# EasyEDA Pro project PROJECT.epro

# Schematic Schematic1
Board Name: Board1; Create Date: 2025-12-16; Page Name: P1; Project Name: Kamo, Rubber Ducky; Schematic Name: Schematic1; Update Date: 2025-12-16; Company: Kamo, a Custom Rubber Ducky; Page Size: A5; Version: V1.0
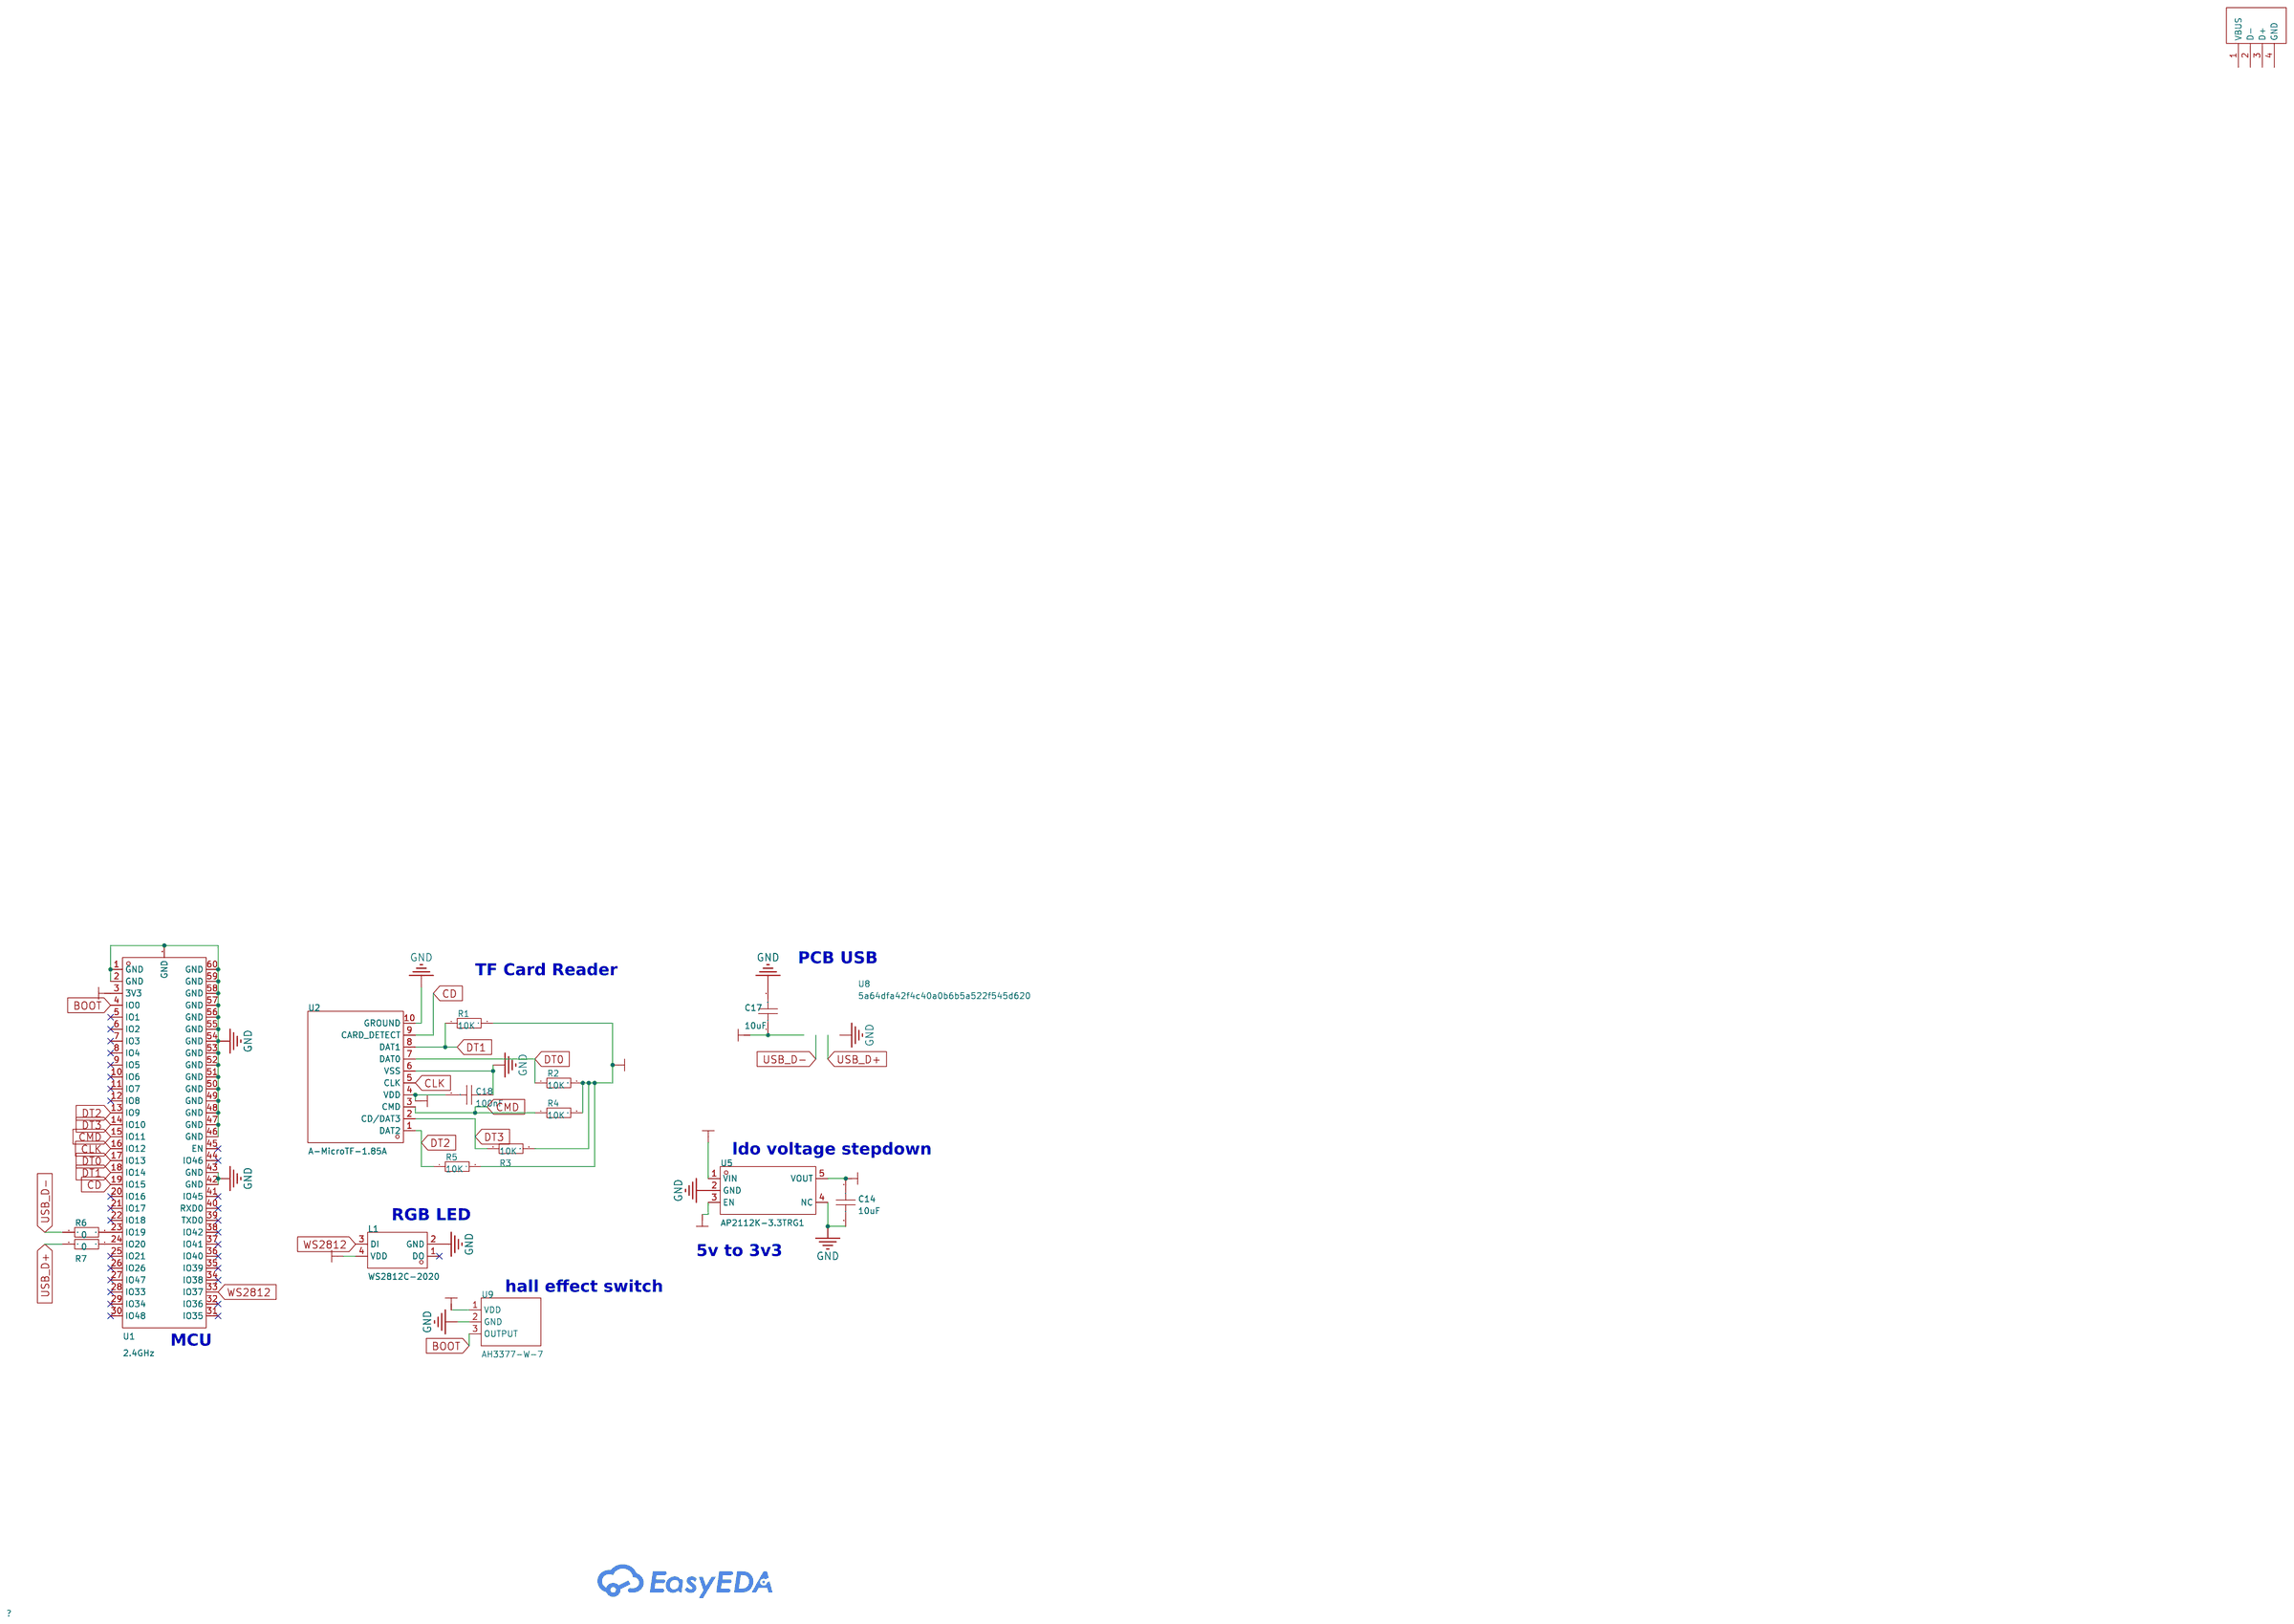
[diagram p0: schematic sheet]

## Parts
C14  10uF  [C0603]
C17  10uF  [C0603]
C18  100nF  [C0603]
L1  WS2812C-2020  [LED-SMD_L2.2-W2.0]
R1  10K  [R0603]
R2  10K  [R0603]
R3  10K  [R0603]
R4  10K  [R0603]
R5  10K  [R0603]
R6  0  [R0603]
R7  0  [R0603]
U1  2.4GHz  [BULETM-SMD_ESP32-S3-MINI-1-N8]
U2  A-MicroTF-1.85A  [TF-SMD_A-MICROTF-1.85A]
U5  AP2112K-3.3TRG1  [SOT-25-5_L2.9-W1.6-P0.95-LS2.8-BL]
U8  5a64dfa42f4c40a0b6b5a522f545d620  [USB-A_PCB]
U9  AH3377-W-7  [SC-59-3_L3.0-W1.6-P0.95-LS2.9-BR-CW]

## Library data of the parts
C14 C17 C18 = CAP_0603: Supplier Footprint: 0603
L1 = WS2812C-2020: Wavelength:460nm；520nm；623nm Operating Temperature:-25℃~+85℃; Supplier Part: C965556; Manufacturer: worldsemi; Supplier Footprint: SMD,2x2mm; Datasheet: https://atta.szlcsc.com/upload/public/pdf/source/20201203/C965556_B52DCEA0E250ABD59F33ED24C4AD3075.pdf; Supplier: LCSC; Wavelength: 460nm；520nm；623nm; Operating Temperature: -25℃~+85℃
R1-R7 = Res_0603: Supplier Footprint: 0603
U1 = ESP32-S3-MINI-1-N8: Core Processor:ESP32-S3FN8 Chip Wireless Standard:- Support Interface:I2C；GPIO；SPI；PWM；ADC；UART；USB；I2S Frequency:2.4GHz Antenna Type:- Output Power:20.5dBm Output Power:20.5dBm Operating Voltage:- Operating Voltage:- Receive  Current:- Send  Current:- Se; Supplier Part: C2913206; Manufacturer: ESPRESSIF(乐鑫); Supplier Footprint: SMD; JLCPCB Part Class: Extended Part; Datasheet: https://atta.szlcsc.com/upload/public/pdf/source/20220425/7F117D7A09F85946280540FD9EFDF9F3.pdf; Supplier: LCSC; Core Processor: ESP32-S3FN8 Chip; Support Interface: I2C；GPIO；SPI；PWM；ADC；UART；USB；I2S; Output Power: 20.5dBm
U2 = A-MicroTF-1.85A: Card Connection Mode:Push-Push Card Type:MicroSD Card (TF Card) Connector Type:Connector and Ejector Additional Card Detection Pins:- Supplementary Features:- Height Above Board:1.85mm Operating Temperature:-25℃~+85℃ Operating Temperature:-25℃~+85℃; LCSC Part Name: 自弹式 MicroSD卡(TF卡) 卡座; Supplier Part: C22467599; Manufacturer: MyAntenna(摩天射频); Supplier Footprint: SMD; JLCPCB Part Class: Extended Part; Datasheet: https://item.szlcsc.com/datasheet/A-MicroTF-1.85A/24170456.html; Supplier: LCSC; Card Connection Mode: Push-Push; Card Type: MicroSD Card (TF Card); Connector Type: Connector and Ejector; Height Above Board: 1.85mm; Operating Temperature: -25℃~+85℃
U5 = AP2112K-3.3TRG1: Output Type:Fixed Maximum Input Voltage:6V Output Voltage:3.3V Output Voltage:3.3V Output Current:600mA Power Supply Rejection Ratio (PSRR):65dB@(1kHz) Dropout Voltage:400mV@(600mA) standby current:80uA Feature:ESD Protection；Automatic Discharge Function；; LCSC Part Name: 输入6V 输出3.3V 600mA; Supplier Part: C51118; Manufacturer: DIODES(美台); Supplier Footprint: SOT-25-5; JLCPCB Part Class: Extended Part; Datasheet: https://atta.szlcsc.com/upload/public/pdf/source/20171221/C51118_15138312998391195590.pdf; Supplier: LCSC; Output Type: Fixed; Maximum Input Voltage: 6V; Output Voltage: 3.3V; Output Current: 600mA; Power Supply Rejection Ratio (PSRR): 65dB@(1kHz); Dropout Voltage: 400mV@(600mA); standby current: 80uA; Feature: ESD Protection；Automatic Discharge Function；Low ESR；Thermal Protection(TSD)；Overcurrent Protection(OCP)；With ability; Operating Temperature: -40℃~+85℃; Output Polarity: Positive electrode; Number of Outputs: 1
U8 = USB-A_PCB
U9 = AH3377-W-7: Type:Unipolar Voltage - Supply:3V~28V Voltage - Supply:3V~28V Operation Points:11.5mT Operation Points:11.5mT Release Points:9mT Release Points:9mT Operating Temperature:-40℃~+125℃ Operating Temperature:-40℃~+125℃ Operating Current:3mA Output Type:Open Dr; LCSC Part Name: 高电压低灵敏度霍尔效应单极开关; Supplier Part: C842204; Manufacturer: DIODES(美台); Supplier Footprint: SC-59; JLCPCB Part Class: Extended Part; Datasheet: https://item.szlcsc.com/datasheet/AH3377-W-7/900535.html; Supplier: LCSC; Type: Unipolar; Voltage - Supply: 3V~28V; Operation Points: 11.5mT; Release Points: 9mT; Operating Temperature: -40℃~+125℃; Operating Current: 3mA; Output Type: Open Drain

## Nets
+3V3: C14.1 C18.2 L1.4(VDD) R1.2 R2.2 R3.2 R4.2 R5.2 U1.3(3V3) U2.4(VDD) U5.5(VOUT) U9.1(VDD)
GND: C14.2 C17.2 C18.1 L1.2(GND) U1.1(GND) U1.2(GND) U1.42(GND) U1.43(GND) U1.46(GND) U1.47(GND) U1.48(GND) U1.49(GND) U1.50(GND) U1.51(GND) U1.52(GND) U1.53(GND) U1.54(GND) U1.55(GND) U1.56(GND) U1.57(GND) U1.58(GND) U1.59(GND) U1.60(GND) U1.GND U2.6(VSS) U2.10(GROUND) U5.2(GND) U5.4(NC) U9.2(GND)
VBUS: C17.1 U5.1(VIN) U5.3(EN)
BOOT: U1.4(IO0) U9.3(OUTPUT)
CD: U1.19(IO15) U2.9(CARD_DETECT)
CLK: U1.16(IO12) U2.5(CLK)
CMD: R4.1 U1.15(IO11) U2.3(CMD)
DT0: R2.1 U1.17(IO13) U2.7(DAT0)
DT1: R1.1 U1.18(IO14) U2.8(DAT1)
DT2: R5.1 U1.13(IO9) U2.1(DAT2)
DT3: R3.1 U1.14(IO10) U2.2(CD/DAT3)
USB_D+: R7.1
USB_D-: R6.1
WS2812: L1.3(DI) U1.33(IO37)
$1N2714: R7.2 U1.24(IO20)
$1N2716: R6.2 U1.23(IO19)

Not connected (* = marked no-connect by the designer): L1 1(DO)*; U1 5(IO1)* 6(IO2)* 7(IO3)* 8(IO4)* 9(IO5)* 10(IO6)* 11(IO7)* 12(IO8)* 20(IO16)* 21(IO17)* 22(IO18)* 25(IO21)* 26(IO26)* 27(IO47)* 28(IO33)* 29(IO34)* 30(IO48)* 31(IO35)* 32(IO36)* 34(IO38)* 35(IO39)* 36(IO40)* 37(IO41)* 38(IO42)* 39(TXD0)* 40(RXD0)* 41(IO45)* 44(IO46)* 45(EN)*; U8 1(VBUS) 2(D-) 3(D+) 4(GND)

## Notes on the sheet
- PCB USB
- TF Card Reader
- ldo voltage stepdown
- RGB LED
- 5v to 3v3
- hall effect switch
- MCU

# Board PCB1
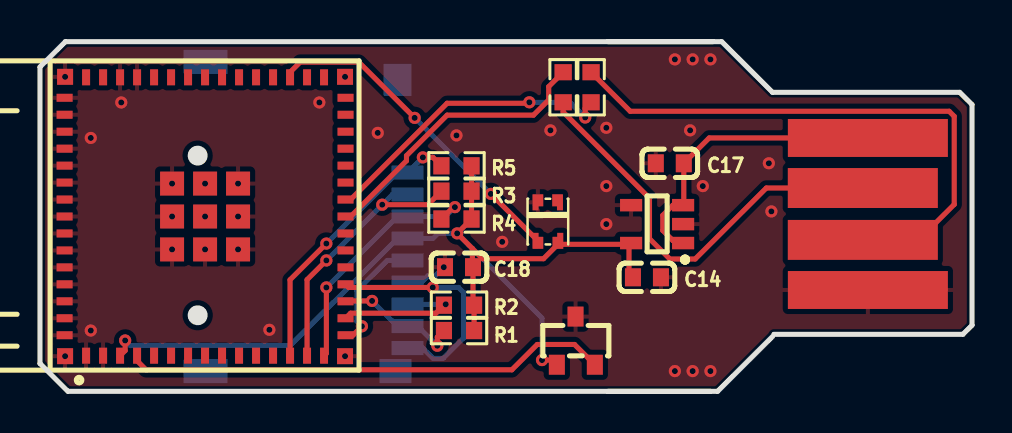
[diagram p1: board, top side]
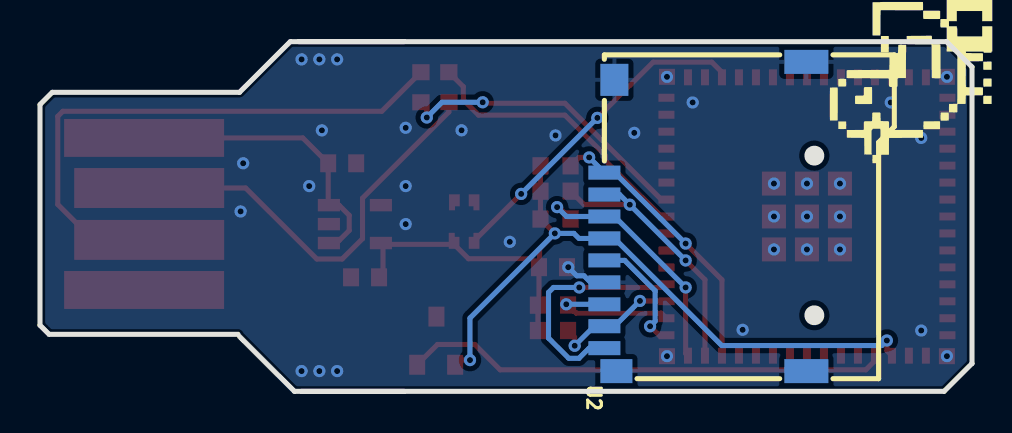
[diagram p2: board, bottom side, seen from below]

Outline 46.61 x 17.53 mm; copper layers: Top Layer, Bottom Layer. Coordinates in mm from the lower left corner of the outline.
Outline path: 33.54,0 1.4,0 0,1.4 0,16.26 1.27,17.53 33.67,17.53 ; 28.39,0 33.88,0 36.63,2.74 ; 28.39,17.53 34.09,17.53 36.63,14.99 45.99,14.99 46.61,14.37 46.61,3.31 46.15,2.86 36.7,2.86
Stack: Top Layer 0.035mm / Dielectric1 1.51mm FR4 er 4.5 / Bottom Layer 0.035mm

## Design rules (mm)
template: JLCPCB Capability(Two Layers Board)
spacing copperThickness1oz (default): track to track 0.102, other pairs 0.152 to 0.3
spacing copperThickness2oz: track to track 0.203, other pairs 0.152 to 0.3
track width copperThickness1oz (default): min 0.127, default 0.254, max 2.54
track width copperThickness2oz: min 0.203, default 0.254, max 2.54
differential pair differentialPair (default): width min 0.127, default 0.254, max 2.54; gap min 0.152, default 0.152
via viaSize (default): diameter min 0.5, default 0.61, max 10; hole min 0.3, default 0.305, max 6.3

## Placement (name value [footprint] x y rotation side)
C14  10uF  [C0603]  30.35 5.72 0 top
C17  10uF  [C0603]  31.5 11.43 180 top
C18  100nF  [C0603]  20.95 6.22 0 top
L1  WS2812C-2020  [LED-SMD_L2.2-W2.0]  25.4 8.51 90 top
R1  10K  [R0603]  20.95 3.05 0 top
R2  10K  [R0603]  20.95 4.32 0 top
R3  10K  [R0603]  20.83 10.03 0 top
R4  10K  [R0603]  20.83 8.64 0 top
R5  10K  [R0603]  20.83 11.3 0 top
R6  0  [R0603]  26.16 15.24 90 top
R7  0  [R0603]  27.56 15.24 270 top
U1  2.4GHz  [BULETM-SMD_ESP32-S3-MINI-1-N8]  8.25 8.76 90 top
U2  A-MicroTF-1.85A  [TF-SMD_A-MICROTF-1.85A]  13.34 8.76 90 bottom
U5  AP2112K-3.3TRG1  [SOT-25-5_L2.9-W1.6-P0.95-LS2.8-BL]  30.86 8.38 90 top
U8  5a64dfa42f4c40a0b6b5a522f545d620  [USB-A_PCB]  37.21 8.89 0 top
U9  AH3377-W-7  [SC-59-3_L3.0-W1.6-P0.95-LS2.9-BR-CW]  26.8 2.54 270 top

## Footprints (pads in the part's own frame, mm; a bottom-side part is the same pattern mirrored in y, then rotated)
BULETM-SMD_ESP32-S3-MINI-1-N8
  rect 0.8x0.4 smd: 1(-6.975,5.95) 2(-6.975,5.1) 3(-6.975,4.25) 4(-6.975,3.4) 5(-6.975,2.55) 6(-6.975,1.7) 7(-6.975,0.85) 8(-6.975,0) 9(-6.975,-0.85) 10(-6.975,-1.7) 11(-6.975,-2.55) 12(-6.975,-3.4) 13(-6.975,-4.25) 14(-6.975,-5.1) 15(-6.975,-5.95) 31(6.975,-5.95) 32(6.975,-5.1) 33(6.975,-4.25) 34(6.975,-3.4) 35(6.975,-2.55) 36(6.975,-1.7) 37(6.975,-0.85) 38(6.975,0) 39(6.975,0.85) 40(6.975,1.7) 41(6.975,2.55) 42(6.975,3.4) 43(6.975,4.25) 44(6.975,5.1) 45(6.975,5.95)
  rect 0.4x0.8 smd: 16(-5.95,-7.025) 17(-5.1,-7.025) 18(-4.25,-7.025) 19(-3.4,-7.025) 20(-2.55,-7.025) 21(-1.7,-7.025) 22(-0.85,-7.025) 23(0,-7.025) 24(0.85,-7.025) 25(1.7,-7.025) 26(2.55,-7.025) 27(3.4,-7.025) 28(4.25,-7.025) 29(5.1,-7.025) 30(5.95,-7.025) 46(5.95,7.025) 47(5.1,7.025) 48(4.25,7.025) 49(3.4,7.025) 50(2.55,7.025) 51(1.7,7.025) 52(0.85,7.025) 53(0,7.025) 54(-0.85,7.025) 55(-1.7,7.025) 56(-2.55,7.025) 57(-3.4,7.025) 58(-4.25,7.025) 59(-5.1,7.025) 60(-5.95,7.025)
  rect 0.8x0.8 smd: GND(-7,7) GND(-7,-7) GND(7,7) GND(7,-7)
  rect 1.2x1.2 smd: GND(-1.65,1.65) GND(-1.65,0) GND(-1.65,-1.65) GND(0,1.65) GND(0,0) GND(0,-1.65) GND(1.65,1.65) GND(1.65,0) GND(1.65,-1.65)
C0603
  rect 0.8x0.9 smd: 1(-0.7,0) 2(0.7,0)
LED-SMD_L2.2-W2.0
  custom 0.8x0.536 smd: 1(0.965,-0.485) 3(-0.966,0.5)
  custom 0.802x0.535 smd: 2(0.965,0.5)
  custom 0.8x0.535 smd: 4(-0.966,-0.5)
R0603
  rect 0.806x0.864 smd: 1(-0.753,0) 2(0.753,0)
SC-59-3_L3.0-W1.6-P0.95-LS2.9-BR-CW
  rect 1x0.8 smd: 1(1.206,-0.95) 2(-1.206,-0.015) 3(1.206,0.95)
SOT-25-5_L2.9-W1.6-P0.95-LS2.8-BL
  rect 0.623x1.105 smd: 1(-0.95,-1.3) 2(-0.001,-1.3) 3(0.95,-1.3) 4(0.95,1.3) 5(-0.95,1.3)
TF-SMD_A-MICROTF-1.85A
  rect 0.7x1.6 smd: 1(2.2,5.05) 2(1.1,5.05) 3(0,5.05) 4(-1.1,5.05) 5(-2.2,5.05) 6(-3.3,5.05) 7(-4.4,5.05) 8(-5.5,5.05) 9(-6.6,5.05)
  rect 1.2x2.2 smd: 10(-7.75,-5.05) 10(7.75,-5.05)
  rect 1.2x1.6 smd: 10(-7.75,4.45)
  rect 1.6x1.4 smd: 10(6.85,4.55)
USB-A_PCB
  rect 8x1.9 smd: 1(4.191,3.81) 4(4.191,-3.81)
  rect 7.5x2 smd: 2(3.937,1.3) 3(3.937,-1.3)

## Nets
+3V3: C14.1 C18.2 L1.4 R1.2 R2.2 R3.2 R4.2 R5.2 U1.3 U2.4 U5.5 U9.1
GND: C14.2 C17.2 C18.1 L1.2 U1.1 U1.2 U1.42 U1.43 U1.46 U1.47 U1.48 U1.49 U1.50 U1.51 U1.52 U1.53 U1.54 U1.55 U1.56 U1.57 U1.58 U1.59 U1.60 U1.GND U2.6 U2.10 U5.2 U5.4 U8.4 U9.2
VBUS: C17.1 U5.1 U5.3 U8.1
BOOT: U1.4 U9.3
CD: U1.19 U2.9
CLK: U1.16 U2.5
CMD: R4.1 U1.15 U2.3
DT0: R2.1 U1.17 U2.7
DT1: R1.1 U1.18 U2.8
DT2: R5.1 U1.13 U2.1
DT3: R3.1 U1.14 U2.2
USB_D+: R7.1 U8.3
USB_D-: R6.1 U8.2
WS2812: L1.3 U1.33
$1N2714: R7.2 U1.24
$1N2716: R6.2 U1.23

Pads without a net: L1 1; U1 5 6 7 8 9 10 11 12 20 21 22 25 26 27 28 29 30 31 32 34 35 36 37 38 39 40 41 44 45

## Via types
v1: diameter 0.61, hole 0.305, Top Layer to Bottom Layer, 54 vias

## Routing (per net, layer and track width the routed paths; a pad name or vN(x,y) marks a point on that pad's centre or on a via; arc(x,y) is an arc through that point)
+3V3: length 48.1
  Top Layer w0.254: U1.3 4.26,2.04 v1(4.26,2.55) ; U9.1 25.61,1.57 v1(25.11,1.57) ; 29.46,7.37 U5.5 ; 29.46,7.37 25.9,7.37 ; 29.46,7.37 29.46,5.91 29.65,5.72 ; 25.9,7.37 L1.4 ; 25.9,7.37 25.18,6.65 22.13,6.65 21.62,7.16 ; 21.62,7.16 v1(20.86,7.92) R4.2 R3.2 R5.2 ; 21.62,7.16 21.62,6.25 21.66,6.22 21.66,4.37 R2.2 R1.2
  Bottom Layer w0.254: v1(25.11,1.57) 25.11,3.67 v1(20.86,7.92) 19.91,7.92 19.66,7.66 17.88,7.66 12.51,2.3 4.51,2.3 v1(4.26,2.55)
GND: length 2.2
  Top Layer w0.254: v1(20.19,6.22) C18.1
  Bottom Layer w0.254: 18.38,5.46 19.07,5.46 19.4,5.79 19.76,5.79 v1(20.19,6.22)
  vias: v1(1.25,15.76) v1(1.25,1.76) v1(2.54,12.7) v1(2.54,3.05) v1(4.06,14.48) v1(6.6,10.41) v1(6.6,8.76) v1(6.6,7.11) v1(8.25,10.41) v1(8.25,8.76) v1(8.25,7.11) v1(9.91,10.41) v1(9.91,8.76) v1(9.91,7.11) v1(11.47,3.08) v1(13.97,14.48) v1(15.25,15.76) v1(15.25,1.76) v1(16.89,12.95) v1(20.83,12.83) v1(23.11,7.49) v1(25.53,13.08) v1(28.32,13.21) v1(28.32,10.29) v1(28.32,8.38) v1(31.75,16.64) v1(31.75,1.02) v1(32.51,13.08) v1(32.64,16.64) v1(32.64,1.02) v1(33.15,10.29) v1(33.53,16.64) v1(33.53,1.02) v1(36.45,11.43) v1(36.58,9.02)
VBUS: length 15.1
  Top Layer w0.254: U5.1 32.04,7.55 31.65,7.55 31.15,8.06 31.15,8.82 31.65,9.33 U5.3 32.2,9.37 C17.1 33.47,12.7 U8.1
BOOT: length 24.3
  Top Layer w0.254: U1.4 4.85,1.53 5.31,1.08 23.6,1.08 24.87,2.35 26.73,2.35 U9.3
CD: length 11.8
  Top Layer w0.254: U1.19 15.44,5.21 v1(19.64,5.21)
  Bottom Layer w0.254: 18.38,2.16 19.15,2.16 19.66,1.66 20.16,1.66 21.18,2.67 21.18,4.96 20.93,5.21 v1(19.64,5.21)
CLK: length 6.1
  Top Layer w0.254: U1.16 15.65,2.81 v1(16.1,3.26)
  Bottom Layer w0.254: 18.38,6.56 17.37,6.56 15.84,5.04 15.84,3.52 v1(16.1,3.26)
CMD: length 12.5
  Top Layer w0.254: v1(20.75,9.23) 20.67,9.23 R4.1 ; U1.15 14.32,1.9 v1(14.32,5.21)
  Bottom Layer w0.254: v1(20.75,9.23) 20.28,8.76 17.88,8.76 v1(14.32,5.21)
DT0: length 7.2
  Top Layer w0.254: U1.17 15.53,3.92 19.8,3.92 R2.1 20.25,4.36 v1(20.29,4.36)
  Bottom Layer w0.254: 18.38,4.36 v1(20.29,4.36)
DT1: length 6.4
  Top Layer w0.254: R1.1 19.87,2.72 v1(19.87,2.29) ; v1(16.61,4.53) 15.3,4.53 U1.18
  Bottom Layer w0.254: v1(16.61,4.53) 17.88,3.26 18.89,3.26 v1(19.87,2.29)
DT2: length 14.1
  Top Layer w0.254: v1(19.15,11.72) 19.65,11.72 R5.1 ; v1(14.32,7.41) 12.5,5.59 U1.13
  Bottom Layer w0.254: v1(19.15,11.72) 18.38,10.96 17.88,10.96 v1(14.32,7.41)
DT3: length 13.8
  Top Layer w0.254: v1(14.32,6.56) 13.35,5.59 U1.14 ; v1(17.12,9.35) 19.4,9.35 R3.1
  Bottom Layer w0.254: v1(14.32,6.56) v1(17.12,9.35) 17.62,9.86 18.38,9.86
USB_D+: length 28.8
  Top Layer w0.254: U8.3 43.94,7.59 45.72,9.37 45.72,13.78 45.47,14.04 29.52,14.04 R7.1
USB_D-: length 21.2
  Top Layer w0.254: U8.2 36.32,10.19 32.77,6.63 31.5,6.63 30.48,7.65 30.48,9.68 26.16,14 R6.1
WS2812: length 16.6
  Top Layer w0.254: v1(22.55,9.9) L1.3 ; 12.5,15.74 12.5,15.99 13.01,16.5 15.94,16.5 v1(18.74,13.71)
  Bottom Layer w0.254: v1(18.74,13.71) v1(22.55,9.9)
$1N2714: length 15.2
  Top Layer w0.254: R7.2 27.27,14.19 v1(27.27,13.72) ; U1.24 15.53,9.61 20.36,14.44 24.42,14.44 v1(24.47,14.49)
  Bottom Layer w0.254: v1(27.27,13.72) 26.5,14.49 v1(24.47,14.49)
$1N2716: length 14.4
  Top Layer w0.254: U1.23 15.53,8.76 18.33,11.56 18.33,11.81 20.36,13.84 24.68,13.84 25.44,14.6 25.44,15.27 R6.2

## Copper pours and planes (outline as drawn; the poured copper is in the pictures)
GND on Top Layer: -0.38,17.78 46.86,17.78 46.86,-0.38 -0.38,-0.38
GND on Bottom Layer: -0.25,18.03 46.86,18.03 46.86,-0.64 -0.25,-0.64
